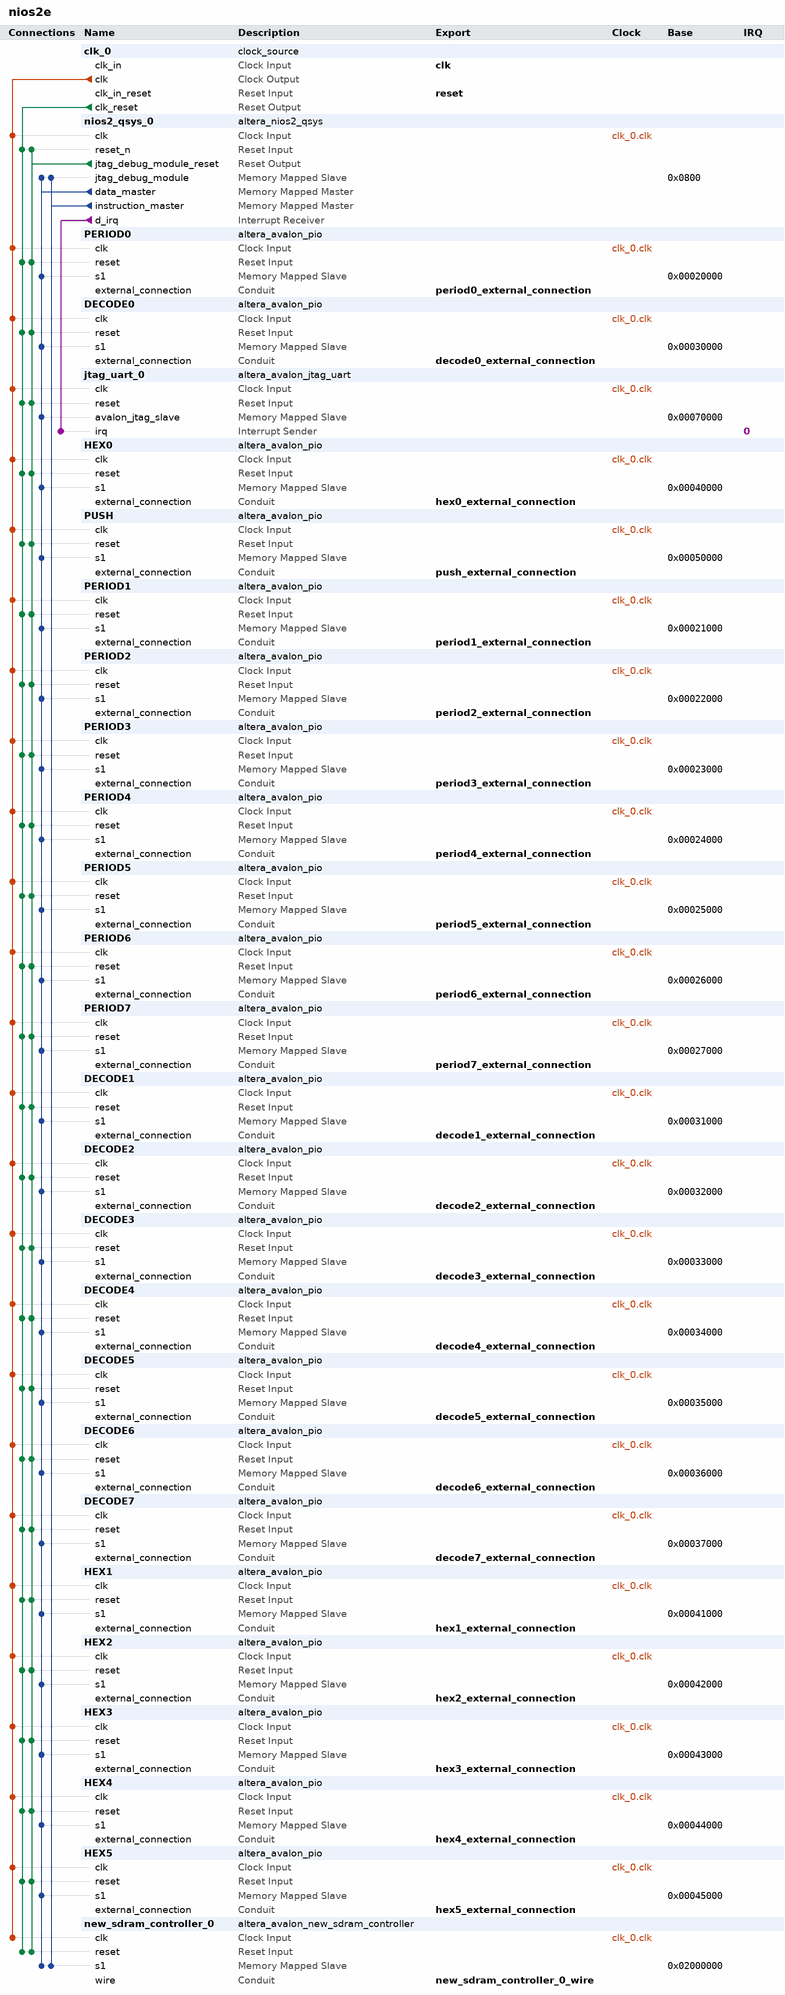
[diagram p0: system contents]
# Platform Designer (Qsys) system nios2e, Cyclone V 5CSEMA5F31C6
# Parameters at their usual value, and those the tool derives, are not listed.
package require -exact qsys 18.1
create_system nios2e
set_project_property DEVICE_FAMILY {Cyclone V}
set_project_property DEVICE 5CSEMA5F31C6

add_instance clk_0 clock_source 18.1
set_instance_parameter_value clk_0 clockFrequency 50000000

add_instance nios2_qsys_0 altera_nios2_qsys 16.1
set_instance_parameter_value nios2_qsys_0 breakSlave nios2_qsys_0.jtag_debug_module
set_instance_parameter_value nios2_qsys_0 exceptionSlave new_sdram_controller_0.s1
set_instance_parameter_value nios2_qsys_0 icache_size 4096
set_instance_parameter_value nios2_qsys_0 impl Tiny
set_instance_parameter_value nios2_qsys_0 mmu_TLBMissExcSlave None
set_instance_parameter_value nios2_qsys_0 resetSlave new_sdram_controller_0.s1
set_instance_parameter_value nios2_qsys_0 resetrequest_enabled true

add_instance PERIOD0 altera_avalon_pio 18.1
set_instance_parameter_value PERIOD0 direction Output
set_instance_parameter_value PERIOD0 width 28

add_instance DECODE0 altera_avalon_pio 18.1
set_instance_parameter_value DECODE0 direction Output
set_instance_parameter_value DECODE0 width 28

add_instance jtag_uart_0 altera_avalon_jtag_uart 18.1
set_instance_parameter_value jtag_uart_0 simInteractiveOptions NO_INTERACTIVE_WINDOWS

add_instance HEX0 altera_avalon_pio 18.1
set_instance_parameter_value HEX0 direction Output
set_instance_parameter_value HEX0 width 8

add_instance PUSH altera_avalon_pio 18.1
set_instance_parameter_value PUSH direction Input
set_instance_parameter_value PUSH width 4

add_instance PERIOD1 altera_avalon_pio 18.1
set_instance_parameter_value PERIOD1 direction Output
set_instance_parameter_value PERIOD1 width 28

add_instance PERIOD2 altera_avalon_pio 18.1
set_instance_parameter_value PERIOD2 direction Output
set_instance_parameter_value PERIOD2 width 28

add_instance PERIOD3 altera_avalon_pio 18.1
set_instance_parameter_value PERIOD3 direction Output
set_instance_parameter_value PERIOD3 width 28

add_instance PERIOD4 altera_avalon_pio 18.1
set_instance_parameter_value PERIOD4 direction Output
set_instance_parameter_value PERIOD4 width 28

add_instance PERIOD5 altera_avalon_pio 18.1
set_instance_parameter_value PERIOD5 direction Output
set_instance_parameter_value PERIOD5 width 28

add_instance PERIOD6 altera_avalon_pio 18.1
set_instance_parameter_value PERIOD6 direction Output
set_instance_parameter_value PERIOD6 width 28

add_instance PERIOD7 altera_avalon_pio 18.1
set_instance_parameter_value PERIOD7 direction Output
set_instance_parameter_value PERIOD7 width 28

add_instance DECODE1 altera_avalon_pio 18.1
set_instance_parameter_value DECODE1 direction Output
set_instance_parameter_value DECODE1 width 28

add_instance DECODE2 altera_avalon_pio 18.1
set_instance_parameter_value DECODE2 direction Output
set_instance_parameter_value DECODE2 width 28

add_instance DECODE3 altera_avalon_pio 18.1
set_instance_parameter_value DECODE3 direction Output
set_instance_parameter_value DECODE3 width 28

add_instance DECODE4 altera_avalon_pio 18.1
set_instance_parameter_value DECODE4 direction Output
set_instance_parameter_value DECODE4 width 28

add_instance DECODE5 altera_avalon_pio 18.1
set_instance_parameter_value DECODE5 direction Output
set_instance_parameter_value DECODE5 width 28

add_instance DECODE6 altera_avalon_pio 18.1
set_instance_parameter_value DECODE6 direction Output
set_instance_parameter_value DECODE6 width 28

add_instance DECODE7 altera_avalon_pio 18.1
set_instance_parameter_value DECODE7 direction Output
set_instance_parameter_value DECODE7 width 28

add_instance HEX1 altera_avalon_pio 18.1
set_instance_parameter_value HEX1 direction Output
set_instance_parameter_value HEX1 width 8

add_instance HEX2 altera_avalon_pio 18.1
set_instance_parameter_value HEX2 direction Output
set_instance_parameter_value HEX2 width 8

add_instance HEX3 altera_avalon_pio 18.1
set_instance_parameter_value HEX3 direction Output
set_instance_parameter_value HEX3 width 8

add_instance HEX4 altera_avalon_pio 18.1
set_instance_parameter_value HEX4 direction Output
set_instance_parameter_value HEX4 width 8

add_instance HEX5 altera_avalon_pio 18.1
set_instance_parameter_value HEX5 direction Output
set_instance_parameter_value HEX5 width 8

add_instance new_sdram_controller_0 altera_avalon_new_sdram_controller 18.1
set_instance_parameter_value new_sdram_controller_0 TAC 5.5
set_instance_parameter_value new_sdram_controller_0 TRCD 20.0
set_instance_parameter_value new_sdram_controller_0 TRP 20.0
set_instance_parameter_value new_sdram_controller_0 casLatency 3
set_instance_parameter_value new_sdram_controller_0 columnWidth 8
set_instance_parameter_value new_sdram_controller_0 dataWidth 16
set_instance_parameter_value new_sdram_controller_0 generateSimulationModel false
set_instance_parameter_value new_sdram_controller_0 model single_Micron_MT48LC4M32B2_7_chip
set_instance_parameter_value new_sdram_controller_0 numberOfBanks 4
set_instance_parameter_value new_sdram_controller_0 numberOfChipSelects 1
set_instance_parameter_value new_sdram_controller_0 powerUpDelay 100.0
set_instance_parameter_value new_sdram_controller_0 refreshPeriod 15.625
set_instance_parameter_value new_sdram_controller_0 rowWidth 13

# connections
add_connection clk_0.clk DECODE0.clk clock
add_connection clk_0.clk DECODE1.clk clock
add_connection clk_0.clk DECODE2.clk clock
add_connection clk_0.clk DECODE3.clk clock
add_connection clk_0.clk DECODE4.clk clock
add_connection clk_0.clk DECODE5.clk clock
add_connection clk_0.clk DECODE6.clk clock
add_connection clk_0.clk DECODE7.clk clock
add_connection clk_0.clk HEX0.clk clock
add_connection clk_0.clk HEX1.clk clock
add_connection clk_0.clk HEX2.clk clock
add_connection clk_0.clk HEX3.clk clock
add_connection clk_0.clk HEX4.clk clock
add_connection clk_0.clk HEX5.clk clock
add_connection clk_0.clk jtag_uart_0.clk clock
add_connection clk_0.clk new_sdram_controller_0.clk clock
add_connection clk_0.clk nios2_qsys_0.clk clock
add_connection clk_0.clk PERIOD0.clk clock
add_connection clk_0.clk PERIOD1.clk clock
add_connection clk_0.clk PERIOD2.clk clock
add_connection clk_0.clk PERIOD3.clk clock
add_connection clk_0.clk PERIOD4.clk clock
add_connection clk_0.clk PERIOD5.clk clock
add_connection clk_0.clk PERIOD6.clk clock
add_connection clk_0.clk PERIOD7.clk clock
add_connection clk_0.clk PUSH.clk clock
add_connection clk_0.clk_reset DECODE0.reset reset
add_connection clk_0.clk_reset DECODE1.reset reset
add_connection clk_0.clk_reset DECODE2.reset reset
add_connection clk_0.clk_reset DECODE3.reset reset
add_connection clk_0.clk_reset DECODE4.reset reset
add_connection clk_0.clk_reset DECODE5.reset reset
add_connection clk_0.clk_reset DECODE6.reset reset
add_connection clk_0.clk_reset DECODE7.reset reset
add_connection clk_0.clk_reset HEX0.reset reset
add_connection clk_0.clk_reset HEX1.reset reset
add_connection clk_0.clk_reset HEX2.reset reset
add_connection clk_0.clk_reset HEX3.reset reset
add_connection clk_0.clk_reset HEX4.reset reset
add_connection clk_0.clk_reset HEX5.reset reset
add_connection clk_0.clk_reset jtag_uart_0.reset reset
add_connection clk_0.clk_reset new_sdram_controller_0.reset reset
add_connection clk_0.clk_reset nios2_qsys_0.reset_n reset
add_connection clk_0.clk_reset PERIOD0.reset reset
add_connection clk_0.clk_reset PERIOD1.reset reset
add_connection clk_0.clk_reset PERIOD2.reset reset
add_connection clk_0.clk_reset PERIOD3.reset reset
add_connection clk_0.clk_reset PERIOD4.reset reset
add_connection clk_0.clk_reset PERIOD5.reset reset
add_connection clk_0.clk_reset PERIOD6.reset reset
add_connection clk_0.clk_reset PERIOD7.reset reset
add_connection clk_0.clk_reset PUSH.reset reset
add_connection nios2_qsys_0.jtag_debug_module_reset DECODE0.reset reset
add_connection nios2_qsys_0.jtag_debug_module_reset DECODE1.reset reset
add_connection nios2_qsys_0.jtag_debug_module_reset DECODE2.reset reset
add_connection nios2_qsys_0.jtag_debug_module_reset DECODE3.reset reset
add_connection nios2_qsys_0.jtag_debug_module_reset DECODE4.reset reset
add_connection nios2_qsys_0.jtag_debug_module_reset DECODE5.reset reset
add_connection nios2_qsys_0.jtag_debug_module_reset DECODE6.reset reset
add_connection nios2_qsys_0.jtag_debug_module_reset DECODE7.reset reset
add_connection nios2_qsys_0.jtag_debug_module_reset HEX0.reset reset
add_connection nios2_qsys_0.jtag_debug_module_reset HEX1.reset reset
add_connection nios2_qsys_0.jtag_debug_module_reset HEX2.reset reset
add_connection nios2_qsys_0.jtag_debug_module_reset HEX3.reset reset
add_connection nios2_qsys_0.jtag_debug_module_reset HEX4.reset reset
add_connection nios2_qsys_0.jtag_debug_module_reset HEX5.reset reset
add_connection nios2_qsys_0.jtag_debug_module_reset jtag_uart_0.reset reset
add_connection nios2_qsys_0.jtag_debug_module_reset new_sdram_controller_0.reset reset
add_connection nios2_qsys_0.jtag_debug_module_reset nios2_qsys_0.reset_n reset
add_connection nios2_qsys_0.jtag_debug_module_reset PERIOD0.reset reset
add_connection nios2_qsys_0.jtag_debug_module_reset PERIOD1.reset reset
add_connection nios2_qsys_0.jtag_debug_module_reset PERIOD2.reset reset
add_connection nios2_qsys_0.jtag_debug_module_reset PERIOD3.reset reset
add_connection nios2_qsys_0.jtag_debug_module_reset PERIOD4.reset reset
add_connection nios2_qsys_0.jtag_debug_module_reset PERIOD5.reset reset
add_connection nios2_qsys_0.jtag_debug_module_reset PERIOD6.reset reset
add_connection nios2_qsys_0.jtag_debug_module_reset PERIOD7.reset reset
add_connection nios2_qsys_0.jtag_debug_module_reset PUSH.reset reset
add_connection nios2_qsys_0.data_master DECODE0.s1 avalon
set_connection_parameter_value nios2_qsys_0.data_master/DECODE0.s1 baseAddress 0x00030000
add_connection nios2_qsys_0.data_master DECODE1.s1 avalon
set_connection_parameter_value nios2_qsys_0.data_master/DECODE1.s1 baseAddress 0x00031000
add_connection nios2_qsys_0.data_master DECODE2.s1 avalon
set_connection_parameter_value nios2_qsys_0.data_master/DECODE2.s1 baseAddress 0x00032000
add_connection nios2_qsys_0.data_master DECODE3.s1 avalon
set_connection_parameter_value nios2_qsys_0.data_master/DECODE3.s1 baseAddress 0x00033000
add_connection nios2_qsys_0.data_master DECODE4.s1 avalon
set_connection_parameter_value nios2_qsys_0.data_master/DECODE4.s1 baseAddress 0x00034000
add_connection nios2_qsys_0.data_master DECODE5.s1 avalon
set_connection_parameter_value nios2_qsys_0.data_master/DECODE5.s1 baseAddress 0x00035000
add_connection nios2_qsys_0.data_master DECODE6.s1 avalon
set_connection_parameter_value nios2_qsys_0.data_master/DECODE6.s1 baseAddress 0x00036000
add_connection nios2_qsys_0.data_master DECODE7.s1 avalon
set_connection_parameter_value nios2_qsys_0.data_master/DECODE7.s1 baseAddress 0x00037000
add_connection nios2_qsys_0.data_master HEX0.s1 avalon
set_connection_parameter_value nios2_qsys_0.data_master/HEX0.s1 baseAddress 0x00040000
add_connection nios2_qsys_0.data_master HEX1.s1 avalon
set_connection_parameter_value nios2_qsys_0.data_master/HEX1.s1 baseAddress 0x00041000
add_connection nios2_qsys_0.data_master HEX2.s1 avalon
set_connection_parameter_value nios2_qsys_0.data_master/HEX2.s1 baseAddress 0x00042000
add_connection nios2_qsys_0.data_master HEX3.s1 avalon
set_connection_parameter_value nios2_qsys_0.data_master/HEX3.s1 baseAddress 0x00043000
add_connection nios2_qsys_0.data_master HEX4.s1 avalon
set_connection_parameter_value nios2_qsys_0.data_master/HEX4.s1 baseAddress 0x00044000
add_connection nios2_qsys_0.data_master HEX5.s1 avalon
set_connection_parameter_value nios2_qsys_0.data_master/HEX5.s1 baseAddress 0x00045000
add_connection nios2_qsys_0.data_master jtag_uart_0.avalon_jtag_slave avalon
set_connection_parameter_value nios2_qsys_0.data_master/jtag_uart_0.avalon_jtag_slave baseAddress 0x00070000
add_connection nios2_qsys_0.data_master new_sdram_controller_0.s1 avalon
set_connection_parameter_value nios2_qsys_0.data_master/new_sdram_controller_0.s1 baseAddress 0x02000000
add_connection nios2_qsys_0.data_master nios2_qsys_0.jtag_debug_module avalon
set_connection_parameter_value nios2_qsys_0.data_master/nios2_qsys_0.jtag_debug_module baseAddress 0x0800
add_connection nios2_qsys_0.data_master PERIOD0.s1 avalon
set_connection_parameter_value nios2_qsys_0.data_master/PERIOD0.s1 baseAddress 0x00020000
add_connection nios2_qsys_0.data_master PERIOD1.s1 avalon
set_connection_parameter_value nios2_qsys_0.data_master/PERIOD1.s1 baseAddress 0x00021000
add_connection nios2_qsys_0.data_master PERIOD2.s1 avalon
set_connection_parameter_value nios2_qsys_0.data_master/PERIOD2.s1 baseAddress 0x00022000
add_connection nios2_qsys_0.data_master PERIOD3.s1 avalon
set_connection_parameter_value nios2_qsys_0.data_master/PERIOD3.s1 baseAddress 0x00023000
add_connection nios2_qsys_0.data_master PERIOD4.s1 avalon
set_connection_parameter_value nios2_qsys_0.data_master/PERIOD4.s1 baseAddress 0x00024000
add_connection nios2_qsys_0.data_master PERIOD5.s1 avalon
set_connection_parameter_value nios2_qsys_0.data_master/PERIOD5.s1 baseAddress 0x00025000
add_connection nios2_qsys_0.data_master PERIOD6.s1 avalon
set_connection_parameter_value nios2_qsys_0.data_master/PERIOD6.s1 baseAddress 0x00026000
add_connection nios2_qsys_0.data_master PERIOD7.s1 avalon
set_connection_parameter_value nios2_qsys_0.data_master/PERIOD7.s1 baseAddress 0x00027000
add_connection nios2_qsys_0.data_master PUSH.s1 avalon
set_connection_parameter_value nios2_qsys_0.data_master/PUSH.s1 baseAddress 0x00050000
add_connection nios2_qsys_0.instruction_master new_sdram_controller_0.s1 avalon
set_connection_parameter_value nios2_qsys_0.instruction_master/new_sdram_controller_0.s1 baseAddress 0x02000000
add_connection nios2_qsys_0.instruction_master nios2_qsys_0.jtag_debug_module avalon
set_connection_parameter_value nios2_qsys_0.instruction_master/nios2_qsys_0.jtag_debug_module baseAddress 0x0800
add_connection nios2_qsys_0.d_irq jtag_uart_0.irq interrupt
set_connection_parameter_value nios2_qsys_0.d_irq/jtag_uart_0.irq irqNumber 0

# exported interfaces
add_interface clk clock sink
set_interface_property clk EXPORT_OF clk_0.clk_in
add_interface decode0_external_connection conduit end
set_interface_property decode0_external_connection EXPORT_OF DECODE0.external_connection
add_interface decode1_external_connection conduit end
set_interface_property decode1_external_connection EXPORT_OF DECODE1.external_connection
add_interface decode2_external_connection conduit end
set_interface_property decode2_external_connection EXPORT_OF DECODE2.external_connection
add_interface decode3_external_connection conduit end
set_interface_property decode3_external_connection EXPORT_OF DECODE3.external_connection
add_interface decode4_external_connection conduit end
set_interface_property decode4_external_connection EXPORT_OF DECODE4.external_connection
add_interface decode5_external_connection conduit end
set_interface_property decode5_external_connection EXPORT_OF DECODE5.external_connection
add_interface decode6_external_connection conduit end
set_interface_property decode6_external_connection EXPORT_OF DECODE6.external_connection
add_interface decode7_external_connection conduit end
set_interface_property decode7_external_connection EXPORT_OF DECODE7.external_connection
add_interface hex0_external_connection conduit end
set_interface_property hex0_external_connection EXPORT_OF HEX0.external_connection
add_interface hex1_external_connection conduit end
set_interface_property hex1_external_connection EXPORT_OF HEX1.external_connection
add_interface hex2_external_connection conduit end
set_interface_property hex2_external_connection EXPORT_OF HEX2.external_connection
add_interface hex3_external_connection conduit end
set_interface_property hex3_external_connection EXPORT_OF HEX3.external_connection
add_interface hex4_external_connection conduit end
set_interface_property hex4_external_connection EXPORT_OF HEX4.external_connection
add_interface hex5_external_connection conduit end
set_interface_property hex5_external_connection EXPORT_OF HEX5.external_connection
add_interface new_sdram_controller_0_wire conduit end
set_interface_property new_sdram_controller_0_wire EXPORT_OF new_sdram_controller_0.wire
add_interface period0_external_connection conduit end
set_interface_property period0_external_connection EXPORT_OF PERIOD0.external_connection
add_interface period1_external_connection conduit end
set_interface_property period1_external_connection EXPORT_OF PERIOD1.external_connection
add_interface period2_external_connection conduit end
set_interface_property period2_external_connection EXPORT_OF PERIOD2.external_connection
add_interface period3_external_connection conduit end
set_interface_property period3_external_connection EXPORT_OF PERIOD3.external_connection
add_interface period4_external_connection conduit end
set_interface_property period4_external_connection EXPORT_OF PERIOD4.external_connection
add_interface period5_external_connection conduit end
set_interface_property period5_external_connection EXPORT_OF PERIOD5.external_connection
add_interface period6_external_connection conduit end
set_interface_property period6_external_connection EXPORT_OF PERIOD6.external_connection
add_interface period7_external_connection conduit end
set_interface_property period7_external_connection EXPORT_OF PERIOD7.external_connection
add_interface push_external_connection conduit end
set_interface_property push_external_connection EXPORT_OF PUSH.external_connection
add_interface reset reset sink
set_interface_property reset EXPORT_OF clk_0.clk_in_reset

set_interconnect_requirement {$system} qsys_mm.clockCrossingAdapter HANDSHAKE
set_interconnect_requirement {$system} qsys_mm.enableEccProtection FALSE
set_interconnect_requirement {$system} qsys_mm.insertDefaultSlave FALSE
set_interconnect_requirement {$system} qsys_mm.maxAdditionalLatency 1

save_system nios2e.qsys
